# Altium schematic sheet SCH - Compute, Flash.SchDoc
size A4; CompanyName: James Cook University; DrawnBy1: Liam McLaren; Organization: James Cook University; Title1: Assignment 2 - qfuse; Revision: 1.6; SheetNumber: 1; SheetTotal: 4; Title2: Compute & Flash; DrawnBy2: Jacob Finger; ProjectName: *ProjectName
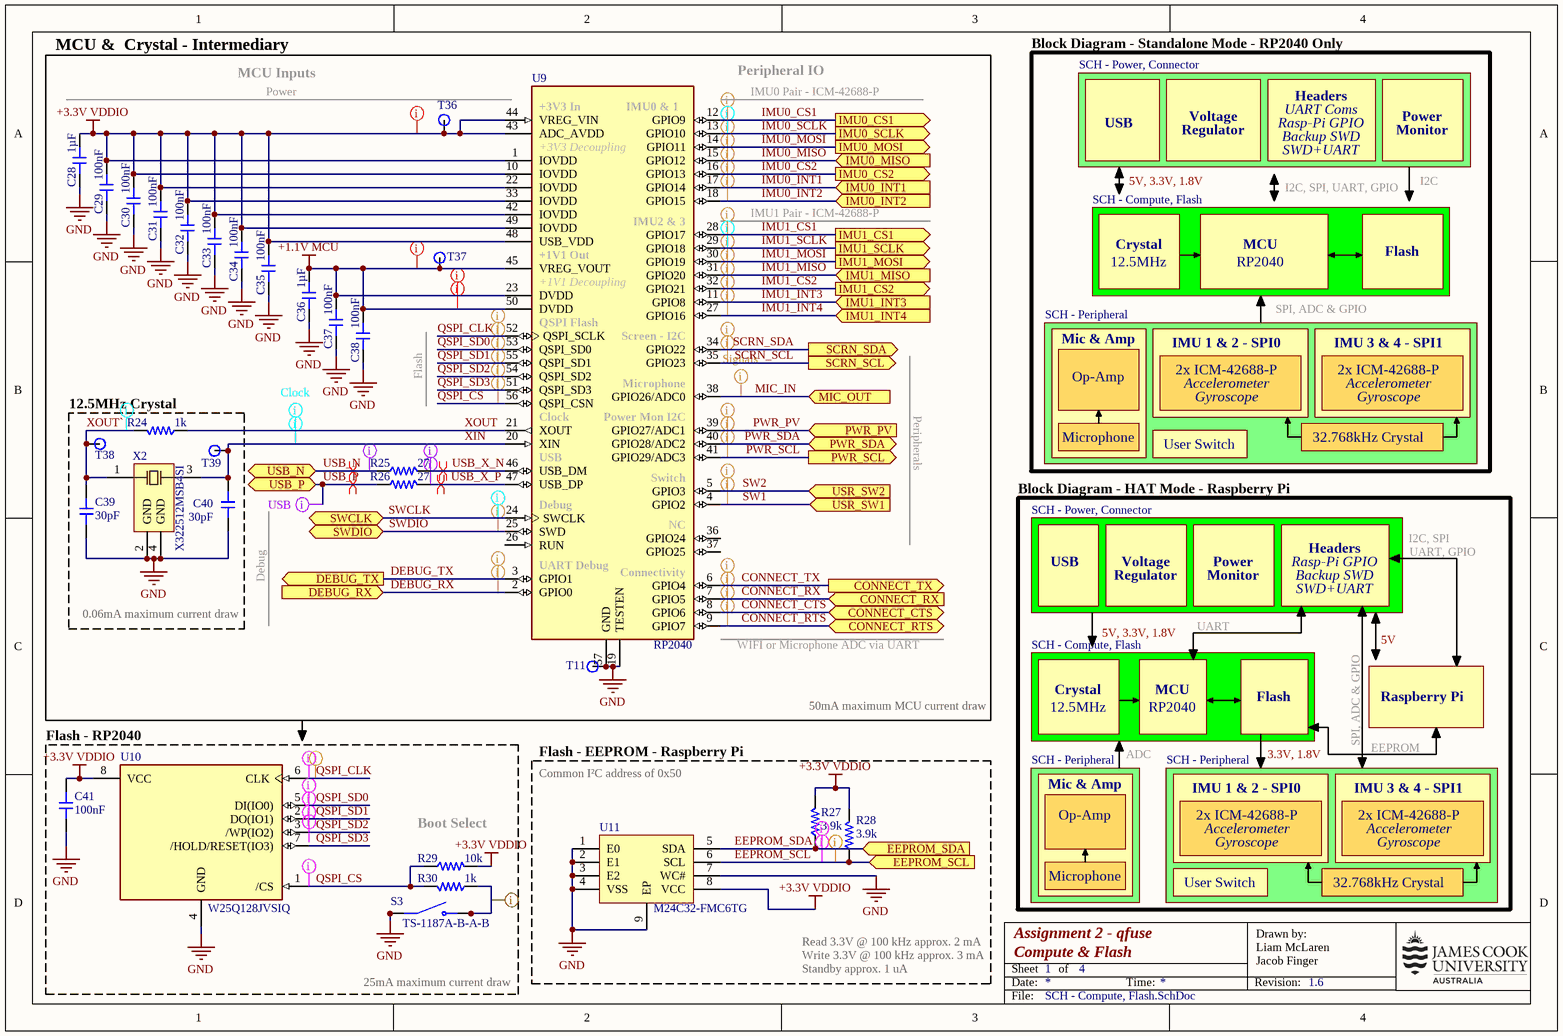
[diagram p0: SCH - Compute, Flash.SchDoc]

## Parts
C28  value 1µF  [CAP-0402]  (hidden comment: CL05A105KA5NQNC)
C29  value 100nF  [CAP-0402]  (hidden comment: CL05B104KB54PNC)
C30  value 100nF  [CAP-0402]  (hidden comment: CL05B104KB54PNC)
C31  value 100nF  [CAP-0402]  (hidden comment: CL05B104KB54PNC)
C32  value 100nF  [CAP-0402]  (hidden comment: CL05B104KB54PNC)
C33  value 100nF  [CAP-0402]  (hidden comment: CL05B104KB54PNC)
C34  value 100nF  [CAP-0402]  (hidden comment: CL05B104KB54PNC)
C35  value 100nF  [CAP-0402]  (hidden comment: CL05B104KB54PNC)
C36  value 1µF  [CAP-0402]  (hidden comment: CL05A105KA5NQNC)
C37  value 100nF  [CAP-0402]  (hidden comment: CL05B104KB54PNC)
C38  value 100nF  [CAP-0402]  (hidden comment: CL05B104KB54PNC)
C39  value 30pF  [CAP-0603]  (hidden comment: 0603CG300J500NT)
C40  value 30pF  [CAP-0603]  (hidden comment: 0603CG300J500NT)
C41  value 100nF  [CAP-0402]  (hidden comment: CL05B104KB54PNC)
R24  value 1k  [RES-0402]  (hidden comment: 0402WGF1001TCE)
R25  value 27  [RES-0603]  (hidden comment: 0603WAF270JT5E)
R26  value 27  [RES-0603]  (hidden comment: 0603WAF270JT5E)
R27  value 3.9k  [RES-0402]  (hidden comment: 0402WGF3901TCE)
R28  value 3.9k  [RES-0402]  (hidden comment: 0402WGF3901TCE)
R29  value 10k  [RES-0402]  (hidden comment: 0402WGF1002TCE)
R30  value 1k  [RES-0402]  (hidden comment: 0402WGF1001TCE)
S3  TS-1187A-B-A-B  [SW_TS-1187A-B-A-B]
T11  TP  [TestPoint]  (value not drawn)  (no BOM)
T36  TP  [TestPoint]  (value not drawn)  (no BOM)
T37  TP  [TestPoint]  (value not drawn)  (no BOM)
T38  TP  [TestPoint]  (value not drawn)  (no BOM)
T39  TP  [TestPoint]  (value not drawn)  (no BOM)
U9  RP2040  [QFN40P700X700X90-57N]
U10  W25Q128JVSIQ  [SOIC127P790X216-8N]
U11  M24C32-FMC6TG  [M24C32-FMC6TG]
X2  X322512MSB4SI  [X322512MSB4SI-Footprint-1]

## Blocks framed on the sheet
MCU &  Crystal - Intermediary: C28-C38 R25 R26 T11 T36 T37 U9
12.5MHz Crystal: C39 C40 R24 T38 T39 X2
Flash - EEPROM - Raspberry Pi: R27 R28 U11

## Sub-sheets
Designator = SCH - Power, Connector: no entries
Designator = SCH - Peripheral: no entries
Designator = SCH - Peripheral: no entries
Designator = SCH - Peripheral: no entries

## Ports
CONNECT_CTS (bidir, see SCH - Power, Connector[4A]), CONNECT_RTS (bidir, see SCH - Power, Connector[4B]), CONNECT_RX (in, see SCH - Power, Connector[4A], SCH - Wireless Coms[3B]), CONNECT_TX (out, see SCH - Power, Connector[4A], SCH - Wireless Coms[3B]), DEBUG_RX (in, see SCH - Power, Connector[2A]), DEBUG_TX (out, see SCH - Power, Connector[2A]), EEPROM_SCL (in, see SCH - Power, Connector[4B]), EEPROM_SDA (in, see SCH - Power, Connector[3B]), IMU0_CS1 (out, see SCH - Peripheral[2A], SCH - Power, Connector[4B]), IMU0_CS2 (out, see SCH - Peripheral[2B], SCH - Power, Connector[4B]), IMU0_INT1 (in, see SCH - Peripheral[1A], SCH - Power, Connector[4B]), IMU0_INT2 (in, see SCH - Peripheral[1B], SCH - Power, Connector[4A]), IMU0_MISO (in, see SCH - Peripheral[2A], SCH - Power, Connector[3B]), IMU0_MOSI (out, see SCH - Peripheral[2A], SCH - Power, Connector[3A]), IMU0_SCLK (out, see SCH - Peripheral[2A], SCH - Power, Connector[3B]), IMU1_CS1 (out, see SCH - Peripheral[4A], SCH - Power, Connector[4A]), IMU1_CS2 (out, see SCH - Peripheral[4B], SCH - Power, Connector[3A]), IMU1_INT3 (in, see SCH - Peripheral[3A], SCH - Power, Connector[4B]), IMU1_INT4 (in, see SCH - Peripheral[3B], SCH - Power, Connector[3B]), IMU1_MISO (in, see SCH - Peripheral[4A], SCH - Power, Connector[3B]), IMU1_MOSI (out, see SCH - Peripheral[4A], SCH - Power, Connector[4B]), IMU1_SCLK (out, see SCH - Peripheral[4A], SCH - Power, Connector[4B]), MIC_OUT (in, see SCH - Peripheral[2D]), PWR_PV (in, see SCH - Power, Connector[3A], SCH - Power, Connector[4C]), PWR_SCL (out, see SCH - Power, Connector[3A], SCH - Power, Connector[4C]), PWR_SDA (bidir, see SCH - Power, Connector[3A], SCH - Power, Connector[4C]), SCRN_SCL (out, see SCH - Power, Connector[2B], SCH - Power, Connector[3A]), SCRN_SDA (out, see SCH - Power, Connector[2B], SCH - Power, Connector[3A]), SWCLK (bidir, see SCH - Power, Connector[1B], SCH - Power, Connector[2A]), SWDIO (bidir, see SCH - Power, Connector[1B], SCH - Power, Connector[2A]), USB_N (bidir, see SCH - Power, Connector[1A]), USB_P (bidir, see SCH - Power, Connector[1A]), USR_SW1 (in, see SCH - Peripheral[3C], SCH - Power, Connector[3B]), USR_SW2 (in, see SCH - Peripheral[3D], SCH - Power, Connector[3B])

## Nets
+1.1V MCU: C36.1 C37.2 C38.2 T37.1(TP) U9.23(DVDD) U9.45(VREG_VOUT) U9.50(DVDD)
+3.3V VDDIO: C28.2 C29.2 C30.2 C31.2 C32.2 C33.2 C34.2 C35.2 C41.2 R27.2 R28.2 R29.2 T36.1(TP) U9.1(IOVDD) U9.10(IOVDD) U9.22(IOVDD) U9.33(IOVDD) U9.42(IOVDD) U9.43(ADC_AVDD) U9.44(VREG_VIN) U9.48(USB_VDD) U9.49(IOVDD) U10.8(VCC) U11.8(VCC)
GND: C28.1 C29.1 C30.1 C31.1 C32.1 C33.1 C34.1 C35.1 C36.2 C37.1 C38.1 C39.1 C40.1 C41.1 S3.A(COM) S3.B(COM) T11.1(TP) U9.19(TESTEN) U9.57(GND) U10.4(GND) U11.1(E0) U11.2(E1) U11.3(E2) U11.4(VSS) U11.7(WC#) U11.9(EP) X2.2(GND) X2.4(GND)
CONNECT_CTS: U9.8(GPIO6) ; port CONNECT_CTS
CONNECT_RTS: U9.9(GPIO7) ; port CONNECT_RTS
CONNECT_RX: U9.7(GPIO5) ; port CONNECT_RX
CONNECT_TX: U9.6(GPIO4) ; port CONNECT_TX
DEBUG_RX: U9.2(GPIO0) ; port DEBUG_RX
DEBUG_TX: U9.3(GPIO1) ; port DEBUG_TX
EEPROM_SCL: R28.1 U11.6(SCL) ; port EEPROM_SCL
EEPROM_SDA: R27.1 U11.5(SDA) ; port EEPROM_SDA
IMU0_CS1: U9.12(GPIO9) ; port IMU0_CS1
IMU0_CS2: U9.16(GPIO13) ; port IMU0_CS2
IMU0_INT1: U9.17(GPIO14) ; port IMU0_INT1
IMU0_INT2: U9.18(GPIO15) ; port IMU0_INT2
IMU0_MISO: U9.15(GPIO12) ; port IMU0_MISO
IMU0_MOSI: U9.14(GPIO11) ; port IMU0_MOSI
IMU0_SCLK: U9.13(GPIO10) ; port IMU0_SCLK
IMU1_CS1: U9.28(GPIO17) ; port IMU1_CS1
IMU1_CS2: U9.32(GPIO21) ; port IMU1_CS2
IMU1_INT3: U9.11(GPIO8) ; port IMU1_INT3
IMU1_INT4: U9.27(GPIO16) ; port IMU1_INT4
IMU1_MISO: U9.31(GPIO20) ; port IMU1_MISO
IMU1_MOSI: U9.30(GPIO19) ; port IMU1_MOSI
IMU1_SCLK: U9.29(GPIO18) ; port IMU1_SCLK
MIC_IN: U9.38(GPIO26/ADC0) ; port MIC_OUT
PWR_PV: U9.39(GPIO27/ADC1) ; port PWR_PV
PWR_SCL: U9.41(GPIO29/ADC3) ; port PWR_SCL
PWR_SDA: U9.40(GPIO28/ADC2) ; port PWR_SDA
QSPI_CLK: U9.52(QSPI_SCLK) U10.6(CLK)
QSPI_CS: R29.1 R30.2 U9.56(QSPI_CSN) U10.1(/CS)
QSPI_SD0: U9.53(QSPI_SD0) U10.5(DI(IO0))
QSPI_SD1: U9.55(QSPI_SD1) U10.2(DO(IO1))
QSPI_SD2: U9.54(QSPI_SD2) U10.3(/WP(IO2))
QSPI_SD3: U9.51(QSPI_SD3) U10.7(/HOLD/RESET(IO3))
SCRN_SCL: U9.35(GPIO23) ; port SCRN_SCL
SCRN_SDA: U9.34(GPIO22) ; port SCRN_SDA
SW1: U9.4(GPIO2) ; port USR_SW1
SW2: U9.5(GPIO3) ; port USR_SW2
SWCLK: U9.24(SWCLK) ; port SWCLK
SWDIO: U9.25(SWD) ; port SWDIO
USB_N: R25.1 ; port USB_N
USB_P: R26.1 ; port USB_P
USB_X_N: R25.2 U9.46(USB_DM)
USB_X_P: R26.2 U9.47(USB_DP)
XIN: C40.2 T39.1(TP) U9.20(XIN) X2.3(OSC2)
XOUT: R24.1 U9.21(XOUT)
XOUT`: C39.2 R24.2 T38.1(TP) X2.1(OSC1)
NetR30_1: R30.1 S3.C(NO) S3.D(NO)

Not connected (* = marked no-connect by the designer): U9 26(RUN) 36(GPIO24) 37(GPIO25)

## Layout directives
differential pair: USB_N, USB_P, USB_X_N, USB_X_P
net class Power: +1.1V MCU, +3.3V VDDIO
net class Signals: (no net found under the mark), CONNECT_CTS, CONNECT_RTS, CONNECT_RX, CONNECT_TX, DEBUG_RX, DEBUG_TX, EEPROM_SCL, EEPROM_SDA, IMU0_CS1, IMU0_CS2, IMU0_INT1, IMU0_INT2, IMU0_MISO, IMU0_MOSI, IMU1_CS1, IMU1_CS2, IMU1_INT3, IMU1_INT4, IMU1_MISO, IMU1_MOSI, MIC_IN, PWR_PV, PWR_SCL, PWR_SDA, QSPI_CLK, QSPI_CS, QSPI_SD0, QSPI_SD1, QSPI_SD2, SCRN_SCL, SCRN_SDA, SW1, SW2, SWDIO
net class QSPI: QSPI_CLK, QSPI_CS, QSPI_SD0, QSPI_SD1, QSPI_SD2, QSPI_SD3
net class Clock: EEPROM_SCL, IMU0_SCLK, IMU1_SCLK, QSPI_CLK, SWCLK, XIN, XOUT, XOUT`
net class USB: USB_N, USB_P, USB_X_N, USB_X_P
net class GND: NetR30_1

## Notes on the sheet
- MCU Inputs
- Power
- Peripheral IO
- IMU0 Pair - ICM-42688-P
- Block Diagram - Standalone Mode - RP2040 Only
- USB
- Voltage
- Regulator
- Headers
- Rasp-Pi GPIO
- UART Coms
- Monitor
- 5V, 3.3V, 1.8V
- Backup SWD
- SWD+UART
- I2C
- (near U9) IMU1 Pair - ICM-42688-P
- SCH - Compute, Flash
- Crystal
- MCU
- I2C, SPI, UART, GPIO
- Flash
- 12.5MHz
- RP2040
- SPI, ADC & GPIO
- Op-Amp
- Mic & Amp
- IMU 1 & 2 - SPI0
- Accelerometer
- 2x ICM-42688-P
- IMU 3 & 4 - SPI1
- Peripherals
- Microphone
- User Switch
- Gyroscope
- 32.768kHz Crystal
- Block Diagram - HAT Mode - Raspberry Pi
- SCH - Power, Connector
- (near C40) Debug
- I2C, SPI
- UART, GPIO
- 0.06mA maximum current draw
- (near U9) WIFI or Microphone ADC via UART
- UART
- 5V
- 50mA maximum MCU current draw
- Raspberry Pi
- Flash - RP2040
- Common I²C address of 0x50
- ADC
- 3.3V, 1.8V
- EEPROM
- Boot Select
- 25mA maximum current draw
- Read 3.3V @ 100 kHz approx. 2 mA
- Write 3.3V @ 100 kHz approx. 3 mA
- Standby approx. 1 uA
- Date:
- Sheet
- of
- Time:
- Revision:
- Drawn by:
- File:
- (in symbol CMP-043-000000-5) +3V3 In; IMU0 & 1; +3V3 Decoupling; IMU2 & 3; +1V1 Out; +1V1 Decoupling; QSPI Flash; Screen - I2C; Microphone; Clock; Power Mon I2C; USB; Switch; Debug; NC; UART Debug; Connectivity

## Library data of the parts
C28 C36 = CMP-001-00140-3: Capacitor, Ceramic (MLCC), 1uF, ±10%, 25V, X5R, ±10%, SMD 0402; Manufacturer: Samsung Electro-Mechanics; Case/Package: 0402; JLCPCB Basic Part: Yes; ComponentLink2URL: https://jlcpcb.com/partdetail/C52923; Source: jlcpcb_capacitors_basic.schlib; ComponentLink1URL: https://datasheet.lcsc.com/lcsc/1811091611_Samsung-Electro-Mechanics-CL05A105KA5NQNC_C52923.pdf; RoHS: Yes; ComponentLink2Description: JLCPCB Part URL; Temperature Coefficient: X5R; ComponentLink3Description: LCSC Part URL; Category: Capacitors - MLCC; Voltage Rating: 25V; Tolerance: 10%; Design Item ID: CL05A105KA5NQNC; ComponentLink3URL: https://lcsc.com/product-detail/Multilayer-Ceramic-Capacitors-MLCC---SMD-SMT_Samsung-Electro-Mechanics-Samsung-Electro-Mechanics-CL05A105KA5NQNC_C52923.html; Manufacturer Part Number: CL05A105KA5NQNC; JLCPCB Part Number: C52923; ComponentLink1Description: Datasheet
C29-C35 C37 C38 C41 = CMP-001-00146-3: Capacitor, Ceramic (MLCC), 100nF, ±10%, 50V, X7R, ±10%, SMD 0402; Manufacturer: Samsung Electro-Mechanics; Design Item ID: CL05B104KB54PNC; Source: jlcpcb_capacitors_basic.schlib; Case/Package: 0402; Temperature Coefficient: X7R; ComponentLink3URL: https://lcsc.com/product-detail/Multilayer-Ceramic-Capacitors-MLCC---SMD-SMT_Samsung-Electro-Mechanics-Samsung-Electro-Mechanics-CL05B104KB54PNC_C307331.html; Manufacturer Part Number: CL05B104KB54PNC; RoHS: Yes; ComponentLink1Description: Datasheet; Voltage Rating: 50V; ComponentLink2Description: JLCPCB Part URL; JLCPCB Basic Part: Yes; Category: Capacitors - MLCC; ComponentLink3Description: LCSC Part URL; ComponentLink2URL: https://jlcpcb.com/partdetail/C307331; JLCPCB Part Number: C307331; Tolerance: 10%; ComponentLink1URL: https://datasheet.lcsc.com/lcsc/1810191222_Samsung-Electro-Mechanics-CL05B104KB54PNC_C307331.pdf
C39 C40 = CMP-001-00132-2: Capacitor, Ceramic (MLCC), 30pF, ±5%, 50V, C0G, ±5%, SMD 0603; Manufacturer: FH(Guangdong Fenghua Advanced Tech); Voltage Rating: 50V; ComponentLink3URL: https://lcsc.com/product-detail/Multilayer-Ceramic-Capacitors-MLCC---SMD-SMT_FH-Guangdong-Fenghua-Advanced-Tech-FH-Guangdong-Fenghua-Advanced-Tech-0603CG300J500NT_C1658.html; JLCPCB Part Number: C1658; ComponentLink3Description: LCSC Part URL; Tolerance: 5%; ComponentLink2Description: JLCPCB Part URL; Category: Capacitors - MLCC; ComponentLink2URL: https://jlcpcb.com/partdetail/C1658; JLCPCB Basic Part: Yes; Source: jlcpcb_capacitors_basic.schlib; Temperature Coefficient: C0G; Case/Package: 0603; ComponentLink1URL: https://datasheet.lcsc.com/lcsc/1810261611_FH--Guangdong-Fenghua-Advanced-Tech-0603CG300J500NT_C1658.pdf; ComponentLink1Description: Datasheet; Design Item ID: 0603CG300J500NT; RoHS: Yes; Manufacturer Part Number: 0603CG300J500NT
R24 R30 = CMP-009-00180-4: Resistor, 1kΩ, ±1%, 62.5mW, 50V, ±100ppm/℃, -55℃~+155℃, SMD 0402; Manufacturer: Uniroyal; Temperature Coefficient: ±100ppm/℃; JLCPCB Part Number: C11702; ComponentLink2URL: https://jlcpcb.com/partdetail/C11702; Power Rating: 62.5mW; JLCPCB Basic Part: Yes; ComponentLink2Description: JLCPCB Part URL; ComponentLink1URL: https://datasheet.lcsc.com/lcsc/2206010216_UNI-ROYAL-Uniroyal-Elec-0402WGF1001TCE_C11702.pdf; Temperature Rating: -55℃~+155℃; Manufacturer Part Number: 0402WGF1001TCE; ComponentLink1Description: Datasheet; Tolerance: 1%; Source: jlcpcb_resistors_basic.schlib; Design Item ID: 0402WGF1001TCE; Case/Package: 0402; Voltage Rating: 50V; Category: Resistors
R25 R26 = CMP-009-00289-2: Resistor, 27Ω, ±1%, 100mW, 75V, ±200ppm/℃, -55℃~+155℃, SMD 0603; Manufacturer: Uniroyal; Design Item ID: 0603WAF270JT5E; Temperature Coefficient: ±200ppm/℃; ComponentLink1URL: https://datasheet.lcsc.com/lcsc/2205311845_UNI-ROYAL-Uniroyal-Elec-0603WAF270JT5E_C25190.pdf; ComponentLink2URL: https://jlcpcb.com/partdetail/C25190; Power Rating: 100mW; JLCPCB Part Number: C25190; Manufacturer Part Number: 0603WAF270JT5E; Source: jlcpcb_resistors_basic.schlib; Voltage Rating: 75V; Tolerance: 1%; Case/Package: 0603; Temperature Rating: -55℃~+155℃; ComponentLink1Description: Datasheet; Category: Resistors; ComponentLink2Description: JLCPCB Part URL; JLCPCB Basic Part: Yes
R27 R28 = CMP-009-00215-4: Resistor, 3.9kΩ, ±1%, 62.5mW, 50V, ±100ppm/℃, -55℃~+155℃, SMD 0402; Manufacturer: Uniroyal; ComponentLink2URL: https://jlcpcb.com/partdetail/C51721; Manufacturer Part Number: 0402WGF3901TCE; ComponentLink1Description: Datasheet; Tolerance: 1%; JLCPCB Basic Part: Yes; Category: Resistors; Voltage Rating: 50V; Case/Package: 0402; Source: jlcpcb_resistors_basic.schlib; Design Item ID: 0402WGF3901TCE; Temperature Rating: -55℃~+155℃; JLCPCB Part Number: C51721; Power Rating: 62.5mW; ComponentLink1URL: https://datasheet.lcsc.com/lcsc/2206010000_UNI-ROYAL-Uniroyal-Elec-0402WGF3901TCE_C51721.pdf; ComponentLink2Description: JLCPCB Part URL; Temperature Coefficient: ±100ppm/℃
R29 = CMP-009-00181-4: Resistor, 10kΩ, ±1%, 62.5mW, 50V, ±100ppm/℃, -55℃~+155℃, SMD 0402; Manufacturer: Uniroyal; ComponentLink1Description: Datasheet; JLCPCB Basic Part: Yes; Temperature Rating: -55℃~+155℃; Power Rating: 62.5mW; ComponentLink2URL: https://jlcpcb.com/partdetail/C25744; ComponentLink2Description: JLCPCB Part URL; Case/Package: 0402; Voltage Rating: 50V; ComponentLink1URL: https://datasheet.lcsc.com/lcsc/2206010100_UNI-ROYAL-Uniroyal-Elec-0402WGF1002TCE_C25744.pdf; Source: jlcpcb_resistors_basic.schlib; Category: Resistors; Design Item ID: 0402WGF1002TCE; Temperature Coefficient: ±100ppm/℃; JLCPCB Part Number: C25744; Tolerance: 1%; Manufacturer Part Number: 0402WGF1002TCE
S3 = CMP-051-000000-5: SPST 50mA @ 12VDC Top Actuated Round Button 160gf SMD Tactile Switches RoHS; Availability: Unavailable; Value: *; Price: None; Design Item ID: TS-1187A-B-A-B; Component Type: Standard; Pin Count: 4; Source: TS-1187A-B-A-B.SchLib; MP: TS-1187A-B-A-B; Package: None; JLCPCB Part Number: C318884
T11 T36-T39 = TestPoint
U9 = CMP-043-000000-5: ARM Cortex-M0+ MCU 32-Bit Microcontroller for Raspberry Pi Pico; Package: None; Price: None; Availability: Available; Design Item ID: RP2040; Component Type: Standard; Pin Count: 57; Source: RP2040.SchLib; Value: *; MP: RP2040; JLCPCB Part Number: C2040
U10 = CMP-031-00006-4: FLASH - NOR Memory IC 128Mb (16M x 8) SPI - Quad I/O, QPI, DTR 133 MHz 8-SOIC; MF: Winbond Electronics; Pin Count: 8; Check_prices: https://www.snapeda.com/parts/W25Q128JVSIQ/Winbond+Electronics/view-part/?ref=eda; Package: SOIC-8 Winbond; MP: W25Q128JVSIQ; Component Type: Standard; Source: W25Q128JVSIQ.SchLib; Design Item ID: W25Q128JVSIQ; Purchase-URL: https://pricing.snapeda.com/search/part/W25Q128JVSIQ/?ref=eda; Price: None; Availability: In Stock; SnapEDA_Link: https://www.snapeda.com/parts/W25Q128JVSIQ/Winbond+Electronics/view-part/?ref=snap; Value: *; JLCPCB Part Number: C97521
U11 = M24C32-FMC6TG: STMicroelectronics M24C32-FMC6TG - UFDFPN-8(2x3) - 32Kbit I2C UFDFPN-8(2x3) EEPROM ROHS; JLCPCB Part Number: C2060985
X2 = CMP-00002-4: 12MHz SMD Crystal Resonator 20pF ±10ppm ±30ppm -40℃~+85℃ SMD3225-4P  Crystals ROHS Yangxing Tech; Max ESR: 80 Ω; Load capacitance: 20 pF; Frequency: 12 MHz; JLCPCB Part Number: C9002